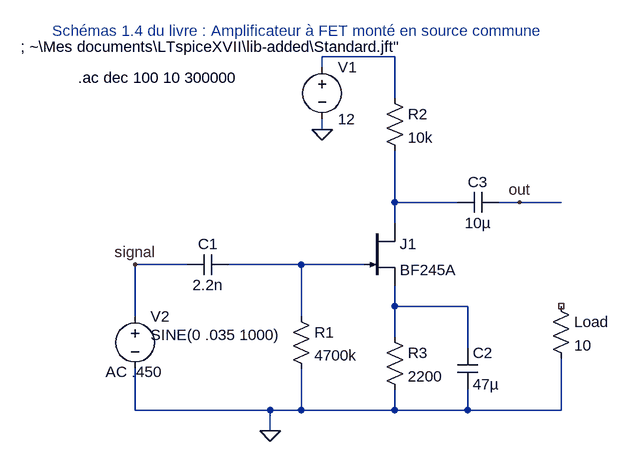
[diagram p0: schematic 1_4-AmpliSourceCommune.asc]
1_4-AmpliSourceCommune.asc, the LTspice schematic file:
Version 4
SHEET 1 1736 760
WIRE 880 64 768 64
WIRE 768 80 768 64
WIRE 880 128 880 64
WIRE 768 176 768 160
WIRE 880 288 880 208
WIRE 976 288 880 288
WIRE 1072 288 1040 288
WIRE 1136 288 1072 288
WIRE 880 320 880 288
WIRE 560 384 480 384
WIRE 736 384 624 384
WIRE 832 384 736 384
WIRE 880 448 880 416
WIRE 992 448 880 448
WIRE 480 464 480 384
WIRE 736 464 736 384
WIRE 880 496 880 448
WIRE 992 512 992 448
WIRE 480 608 480 544
WIRE 688 608 480 608
WIRE 736 608 736 544
WIRE 736 608 688 608
WIRE 880 608 880 576
WIRE 880 608 736 608
WIRE 992 608 992 576
WIRE 992 608 880 608
WIRE 1136 608 1136 528
WIRE 1136 608 992 608
WIRE 688 640 688 608
FLAG 768 176 0
FLAG 688 640 0
FLAG 1072 288 out
FLAG 480 384 signal
SYMBOL voltage 768 64 R0
WINDOW 123 0 0 Left 0
WINDOW 39 0 0 Left 0
SYMATTR InstName V1
SYMATTR Value 12
SYMBOL voltage 480 448 R0
WINDOW 123 -45 101 Left 2
WINDOW 39 0 0 Left 0
WINDOW 3 24 44 Left 2
SYMATTR Value2 AC .450
SYMATTR Value SINE(0 .035 1000)
SYMATTR InstName V2
SYMBOL res 864 112 R0
SYMATTR InstName R2
SYMATTR Value 10k
SYMBOL res 864 480 R0
SYMATTR InstName R3
SYMATTR Value 2200
SYMBOL cap 624 368 R90
WINDOW 0 0 32 VBottom 2
WINDOW 3 32 32 VTop 2
SYMATTR InstName C1
SYMATTR Value 2.2n
SYMBOL cap 976 304 R270
WINDOW 0 32 32 VTop 2
WINDOW 3 0 32 VBottom 2
SYMATTR InstName C3
SYMATTR Value 10µ
SYMBOL res 1120 432 R0
SYMATTR InstName Load
SYMATTR Value 10
SYMBOL res 720 448 R0
SYMATTR InstName R1
SYMATTR Value 4700k
SYMBOL cap 976 512 R0
SYMATTR InstName C2
SYMATTR Value 47µ
SYMBOL njf 832 320 R0
SYMATTR InstName J1
SYMATTR Value BF245A
TEXT 352 24 Left 2 ;Schémas 1.4 du livre : Amplificateur à FET monté en source commune
TEXT 392 96 Left 2 !.ac dec 100 10 300000
TEXT 304 48 Left 2 !; ~\\Mes documents\\LTspiceXVII\\lib-added\\Standard.jft"

The netlist it stands for:
* 1_4-AmpliSourceCommune.asc
V1 N001 0 12
V2 signal 0 SINE(0 .035 1000) AC .450
R2 N001 N002 10k
R3 N004 0 2200
C1 N003 signal 2.2n
C3 N002 out 10µ
R§Load NC_01 0 10
R1 N003 0 4700k
C2 N004 0 47µ
J1 N002 N003 N004 BF245A
.model NJF NJF
.model PJF PJF
.lib standard.jft
* Schémas 1.4 du livre : Amplificateur à FET monté en source commune
.ac dec 100 10 300000
; ~\Mes documents\LTspiceXVII\lib-added\Standard.jft"
.backanno
.end